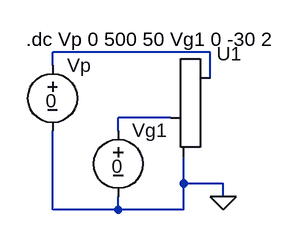
[diagram p0: schematic TriodCar.asc]
TriodCar.asc, the LTspice schematic file:
Version 4
SHEET 1 880 680
WIRE 48 112 -144 112
WIRE -144 128 -144 112
WIRE 48 144 48 112
WIRE 0 192 -64 192
WIRE -64 208 -64 192
WIRE 16 272 16 240
WIRE 64 272 16 272
WIRE 64 288 64 272
WIRE -144 304 -144 208
WIRE -64 304 -64 288
WIRE -64 304 -144 304
WIRE 16 304 16 272
WIRE 16 304 -64 304
FLAG 64 288 0
SYMBOL voltage -144 112 R0
WINDOW 0 18 16 Left 0
WINDOW 3 -8 59 Left 0
SYMATTR InstName Vp
SYMATTR Value 0
SYMBOL voltage -64 192 R0
WINDOW 0 17 15 Left 0
WINDOW 3 -8 59 Left 0
SYMATTR InstName Vg1
SYMATTR Value 0
SYMBOL Valve\\triode 48 192 R0
SYMATTR InstName U1
SYMATTR SpiceModel 12AU7
TEXT -176 96 Left 0 !.dc Vp 0 500 50 Vg1 0 -30 2

The netlist it stands for:
* TriodCar.asc
Vp N001 0 0
Vg1 N002 0 0
XU1 N001 N002 0 12AU7
.dc Vp 0 500 50 Vg1 0 -30 2
.backanno
.end